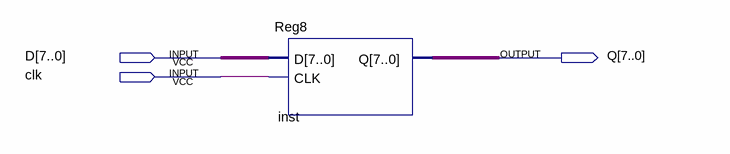
[diagram p0: schematic sheet]
// Quartus schematic reg1021.bdf as structural Verilog: 1 symbols, 3 pins
module reg1021 (
  input  [7:0] D,
  input  clk,
  output [7:0] Q
);

  Reg8 inst (.D(D), .CLK(clk), .Q(Q));
endmodule
